# Altium project N64_Controller.PrjPcb
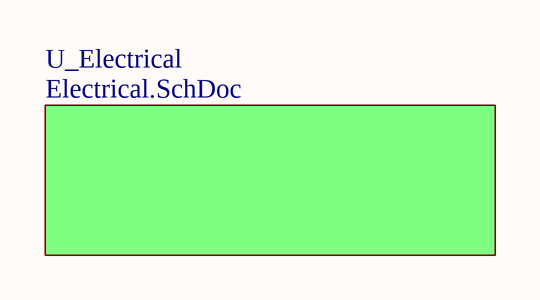
[diagram p0: TopSheet.SchDoc]
8 sheets, 143 parts. Net scope: strictly hierarchical (ports join the sheet entries above them; power ports are local).
Board file: PCB1.PcbDoc
Sheets:
  TopSheet.SchDoc
    U_Electrical = Electrical.SchDoc
      U_MCU = MCU.SchDoc
      U_LEDs = LEDs.SchDoc
      U_Rumble = Rumble.SchDoc
      U_Power = Power.SchDoc
      U_Buttons = Buttons.SchDoc
      U_USB = USB.SchDoc

## Sheet TopSheet.SchDoc
size A4

### Sub-sheets
U_Electrical = Electrical.SchDoc: no entries

### Notes on the sheet
- Title
- Size:
- Date:
- A4
- Number:
- Time:
- Revision:
- Sheet
- of
- File:

## Sheet Electrical.SchDoc
size A4
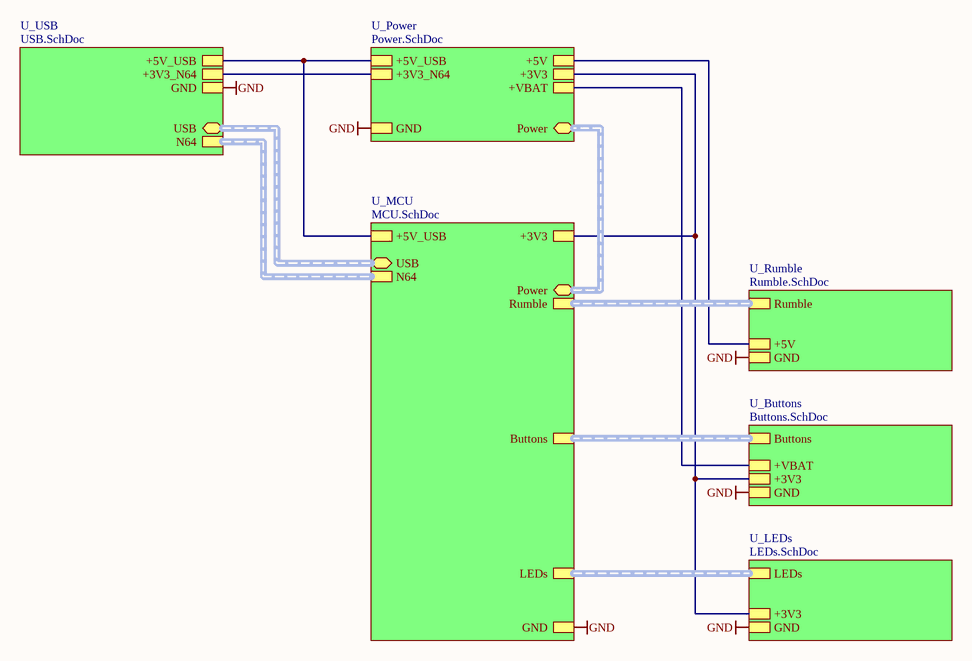
[diagram p1: Electrical.SchDoc]

### Sub-sheets
U_Buttons = Buttons.SchDoc: Buttons (harness Buttons), GND, +3V3, +VBAT
U_LEDs = LEDs.SchDoc: LEDs (harness LEDs), +3V3, GND
U_MCU = MCU.SchDoc: Buttons (harness Buttons), LEDs (harness LEDs), Rumble (harness Rumble), +3V3, +5V_USB, GND, N64 (harness N64), Power (harness Power), USB (harness USB)
U_Power = Power.SchDoc: +5V_USB, +3V3_N64, GND, +5V, +3V3, +VBAT, Power (harness Power)
U_Rumble = Rumble.SchDoc: GND, +5V, Rumble (harness Rumble)
U_USB = USB.SchDoc: +5V_USB, GND, N64 (harness N64), +3V3_N64, USB (harness USB)

### Nets
+3V3: sheet U_MCU/+3V3, sheet U_LEDs/+3V3, sheet U_Power/+3V3, sheet U_Buttons/+3V3
+3V3_N64: sheet U_Power/+3V3_N64, sheet U_USB/+3V3_N64
+5V: sheet U_Rumble/+5V, sheet U_Power/+5V
+5V_USB: sheet U_MCU/+5V_USB, sheet U_Power/+5V_USB, sheet U_USB/+5V_USB
+VBAT: sheet U_Power/+VBAT, sheet U_Buttons/+VBAT
GND: sheet U_MCU/GND, sheet U_LEDs/GND, sheet U_Rumble/GND, sheet U_Power/GND, sheet U_Buttons/GND, sheet U_USB/GND

### Buses and harness runs
harness sheet U_Buttons/Buttons = sheet U_MCU/Buttons
harness sheet U_LEDs/LEDs = sheet U_MCU/LEDs
harness sheet U_MCU/N64 = sheet U_USB/N64
harness sheet U_MCU/Power = sheet U_Power/Power
harness sheet U_MCU/Rumble = sheet U_Rumble/Rumble
harness sheet U_MCU/USB = sheet U_USB/USB

### Notes on the sheet
- Title
- Size:
- Date:
- A4
- Number:
- Time:
- Revision:
- Sheet
- of
- File:

## Sheet MCU.SchDoc: N64 Controller
size A4; Author: TheComet; Revision: 1.0.0; ProjectName: N64 Controller
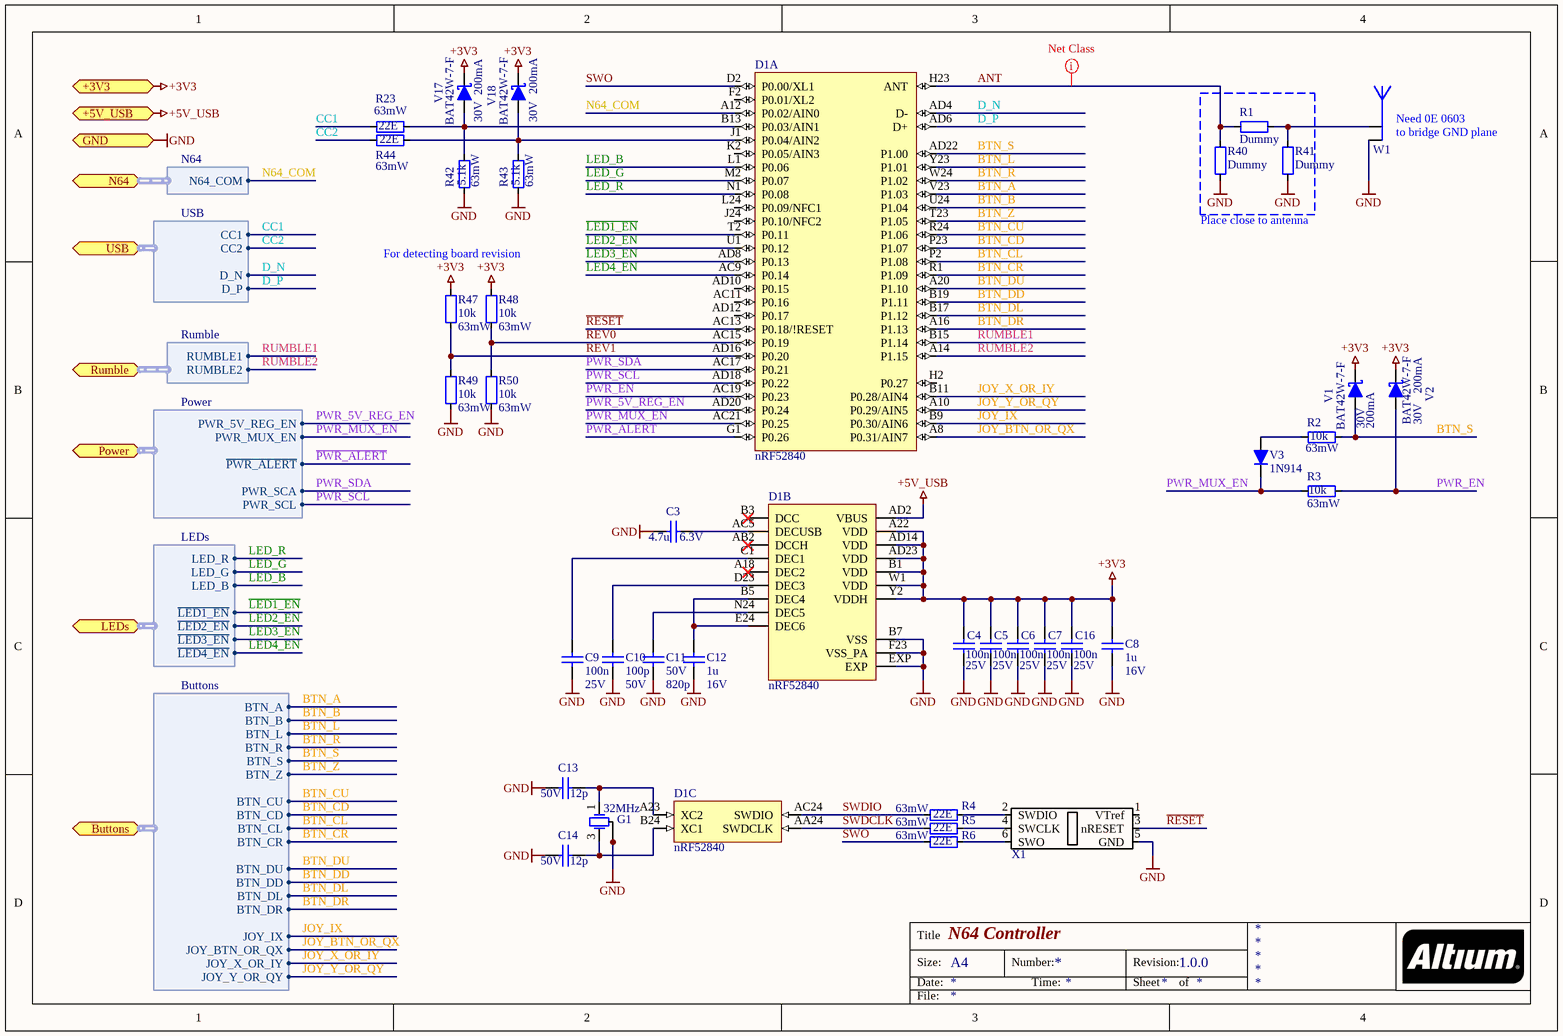
[diagram p2: MCU.SchDoc]

### Parts
C3  value 4.7u  Value2: 6.3V  [SMD_CAP_0603]  (hidden comment: C_SMD_CER_4U7_6V3_10%_X5R_0603)
C4  value 100n  Value2: 25V  [SMD_CAP_0402]  (hidden comment: C_SMD_CER_100N_25V_10%_X7R_0402)
C5  value 100n  Value2: 25V  [SMD_CAP_0402]  (hidden comment: C_SMD_CER_100N_25V_10%_X7R_0402)
C6  value 100n  Value2: 25V  [SMD_CAP_0402]  (hidden comment: C_SMD_CER_100N_25V_10%_X7R_0402)
C7  value 100n  Value2: 25V  [SMD_CAP_0402]  (hidden comment: C_SMD_CER_100N_25V_10%_X7R_0402)
C8  value 1u  Value2: 16V  [SMD_CAP_0603]  (hidden comment: C_SMD_CER_1U_16V_10%_X7R_0603)
C9  value 100n  Value2: 25V  [SMD_CAP_0402]  (hidden comment: C_SMD_CER_100N_25V_10%_X7R_0402)
C10  value 100p  Value2: 50V  [SMD_CAP_0402]  (hidden comment: C_SMD_CER_100P_50V_5%_NP0_0402)
C11  value 820p  Value2: 50V  [SMD_CAP_0402]  (hidden comment: C_SMD_CER_820P_50V_5%_NP0_0402)
C12  value 1u  Value2: 16V  [SMD_CAP_0603]  (hidden comment: C_SMD_CER_1U_16V_10%_X7R_0603)
C13  value 12p  Value2: 50V  [SMD_CAP_0402]  (hidden comment: C_SMD_CER_12P_50V_2%_NP0_0402)
C14  value 12p  Value2: 50V  [SMD_CAP_0402]  (hidden comment: C_SMD_CER_12P_50V_2%_NP0_0402)
C16  value 100n  Value2: 25V  [SMD_CAP_0402]  (hidden comment: C_SMD_CER_100N_25V_10%_X7R_0402)
D1  Type: nRF52840  [SMD_aQFN_73_nRF52840]  (hidden comment: D_NRF52840_aQFN-73)  (parts A,B,C of 3)
G1  value 32MHz  [SMD_QUARZ_3.2X2.5]  (hidden comment: G_SMD_OSC_XTAL_32MHZ_10PPM_8PF_40OHM)
R1  Dummy  [SMD_RES_0402]
R2  value 10k  Value2: 63mW  [SMD_RES_0402]  (hidden comment: R_SMD_THINFILM_10K_0W063_0%5_25PPM_0402)
R3  value 10k  Value2: 63mW  [SMD_RES_0402]  (hidden comment: R_SMD_THINFILM_10K_0W063_0%5_25PPM_0402)
R4  value 22E  Value2: 63mW  [SMD_RES_0402]  (hidden comment: R_SMD_THICKFILM_22E_0W063_1%_100PPM_0402)
R5  value 22E  Value2: 63mW  [SMD_RES_0402]  (hidden comment: R_SMD_THICKFILM_22E_0W063_1%_100PPM_0402)
R6  value 22E  Value2: 63mW  [SMD_RES_0402]  (hidden comment: R_SMD_THICKFILM_22E_0W063_1%_100PPM_0402)
R23  value 22E  Value2: 63mW  [SMD_RES_0402]  (hidden comment: R_SMD_THICKFILM_22E_0W063_1%_100PPM_0402)
R40  Dummy  [SMD_RES_0402]
R41  Dummy  [SMD_RES_0402]
R42  value 5.1k  Value2: 63mW  [SMD_CAP_0402]  (hidden comment: R_SMD_THINFILM_5K1_0W063_0%5_25PPM_0402)
R43  value 5.1k  Value2: 63mW  [SMD_CAP_0402]  (hidden comment: R_SMD_THINFILM_5K1_0W063_0%5_25PPM_0402)
R44  value 22E  Value2: 63mW  [SMD_RES_0402]  (hidden comment: R_SMD_THICKFILM_22E_0W063_1%_100PPM_0402)
R47  value 10k  Value2: 63mW  [SMD_RES_0402]  (hidden comment: R_SMD_THINFILM_10K_0W063_0%5_25PPM_0402)
R48  value 10k  Value2: 63mW  [SMD_RES_0402]  (hidden comment: R_SMD_THINFILM_10K_0W063_0%5_25PPM_0402)
R49  value 10k  Value2: 63mW  [SMD_RES_0402]  (hidden comment: R_SMD_THINFILM_10K_0W063_0%5_25PPM_0402)
R50  value 10k  Value2: 63mW  [SMD_RES_0402]  (hidden comment: R_SMD_THINFILM_10K_0W063_0%5_25PPM_0402)
V1  value 30V  Type: BAT42W-7-F  Value2: 200mA  [SMD_SOD_123]  (hidden comment: V_SMD_SCHOTTKY_BAT42W-7-F_30V_0A2_SOD-123)
V2  value 30V  Type: BAT42W-7-F  Value2: 200mA  [SMD_SOD_123]  (hidden comment: V_SMD_SCHOTTKY_BAT42W-7-F_30V_0A2_SOD-123)
V3  Type: 1N914  [SMD_SOD_323]  (hidden comment: V_SMD_DIODE_1N914_75V_0A15_SOD-323)
V17  value 30V  Type: BAT42W-7-F  Value2: 200mA  [SMD_SOD_123]  (hidden comment: V_SMD_SCHOTTKY_BAT42W-7-F_30V_0A2_SOD-123)
V18  value 30V  Type: BAT42W-7-F  Value2: 200mA  [SMD_SOD_123]  (hidden comment: V_SMD_SCHOTTKY_BAT42W-7-F_30V_0A2_SOD-123)
W1  W_BLUETOOTH_IFA_1MM  [BLUETOOTH_IFA_1MM]  (value not drawn)
X1  X_J-LINK_6-PIN_NEEDLE_HEADER  [SMD_J-LINK_6-PIN_NEEDLE]  (value not drawn)

### Ports
+3V3, +5V_USB, Buttons (harness Buttons), GND, LEDs (harness LEDs), N64 (harness N64), Power (harness Power), Rumble (harness Rumble), USB (harness USB)

### Harnesses
LEDs: LED_R, LED_G, LED_B, ~{LED1_EN}, ~{LED2_EN}, ~{LED3_EN}, ~{LED4_EN}
Rumble: RUMBLE1, RUMBLE2
N64: N64_COM
Buttons: BTN_A, BTN_B, BTN_CD, BTN_CL, BTN_CR, BTN_CU, BTN_DD, BTN_DL, BTN_DR, BTN_DU, BTN_L, BTN_R, BTN_S, BTN_Z, JOY_BTN_OR_QX, JOY_IX, JOY_X_OR_IY, JOY_Y_OR_QY
Power: ~{PWR_ALERT}, PWR_5V_REG_EN, PWR_MUX_EN, PWR_SCA, PWR_SCL
USB: CC1, CC2, D_N, D_P

### Nets
+3V3: C4.2 C5.2 C6.2 C7.2 C8.2 C16.2 D1.A22(VDD) D1.AD14(VDD) D1.AD23(VDD) D1.B1(VDD) D1.W1(VDD) D1.Y2(VDDH) R47.1 R48.1 V1.2 V2.2 V17.2 V18.2 ; port +3V3
+5V_USB: D1.AD2(VBUS) ; port +5V_USB
GND: C3.1 C4.1 C5.1 C6.1 C7.1 C8.1 C9.2 C10.1 C11.1 C12.1 C13.1 C14.1 C16.1 D1.B7(VSS) D1.EXP D1.F23(VSS_PA) G1.2 G1.4 R40.1 R41.1 R42.1 R43.1 R49.2 R50.2 W1.1(GND) X1.5(GND) ; port GND
ANT: D1.H23(ANT) R1.1 R40.2
BTN_A: D1.V23(P1.03) ; port Buttons.BTN_A
BTN_B: D1.U24(P1.04) ; port Buttons.BTN_B
BTN_CD: D1.P23(P1.07) ; port Buttons.BTN_CD
BTN_CL: D1.P2(P1.08) ; port Buttons.BTN_CL
BTN_CR: D1.R1(P1.09) ; port Buttons.BTN_CR
BTN_CU: D1.R24(P1.06) ; port Buttons.BTN_CU
BTN_DD: D1.B19(P1.11) ; port Buttons.BTN_DD
BTN_DL: D1.B17(P1.12) ; port Buttons.BTN_DL
BTN_DR: D1.A16(P1.13) ; port Buttons.BTN_DR
BTN_DU: D1.A20(P1.10) ; port Buttons.BTN_DU
BTN_L: D1.Y23(P1.01) ; port Buttons.BTN_L
BTN_R: D1.W24(P1.02) ; port Buttons.BTN_R
BTN_S: D1.AD22(P1.00) R2.2 V1.1 ; port Buttons.BTN_S
BTN_Z: D1.T23(P1.05) ; port Buttons.BTN_Z
CC1: R23.1 ; port USB.CC1
CC2: R44.1 ; port USB.CC2
D_N: D1.AD4(D-) ; port USB.D_N
D_P: D1.AD6(D+) ; port USB.D_P
JOY_BTN_OR_QX: D1.A8(P0.31/AIN7) ; port Buttons.JOY_BTN_OR_QX
JOY_IX: D1.B9(P0.30/AIN6) ; port Buttons.JOY_IX
JOY_X_OR_IY: D1.B11(P0.28/AIN4) ; port Buttons.JOY_X_OR_IY
JOY_Y_OR_QY: D1.A10(P0.29/AIN5) ; port Buttons.JOY_Y_OR_QY
~{LED1_EN}: D1.T2(P0.11) ; port LEDs.~{LED1_EN}
~{LED2_EN}: D1.U1(P0.12) ; port LEDs.~{LED2_EN}
~{LED3_EN}: D1.AD8(P0.13) ; port LEDs.~{LED3_EN}
~{LED4_EN}: D1.AC9(P0.14) ; port LEDs.~{LED4_EN}
LED_B: D1.L1(P0.06) ; port LEDs.LED_B
LED_G: D1.M2(P0.07) ; port LEDs.LED_G
LED_R: D1.N1(P0.08) ; port LEDs.LED_R
N64_COM: D1.A12(P0.02/AIN0) ; port N64.N64_COM
~{PWR_ALERT}: D1.G1(P0.26) ; port Power.~{PWR_ALERT}
PWR_5V_REG_EN: D1.AD20(P0.24) ; port Power.PWR_5V_REG_EN
PWR_EN: D1.AC19(P0.23) R3.2 V2.1
PWR_MUX_EN: D1.AC21(P0.25) R3.1 V3.2 ; port Power.PWR_MUX_EN
PWR_SCL: D1.AD18(P0.22) ; port Power.PWR_SCL
PWR_SDA: D1.AC17(P0.21) ; port Power.PWR_SCA
~{RESET}: D1.AC13(P0.18/!RESET) X1.3(nRESET)
REV0: D1.AC15(P0.19) R48.2 R50.1
REV1: D1.AD16(P0.20) R47.2 R49.1
RUMBLE1: D1.B15(P1.14) ; port Rumble.RUMBLE1
RUMBLE2: D1.A14(P1.15) ; port Rumble.RUMBLE2
SWDCLK: D1.AA24(SWDCLK) R5.1
SWDIO: D1.AC24(SWDIO) R4.1
SWO: D1.D2(P0.00/XL1) R6.1
NetC3_2: C3.2 D1.AC5(DECUSB)
NetC9_1: C9.1 D1.C1(DEC1)
NetC10_2: C10.2 D1.D23(DEC3)
NetC11_2: C11.2 D1.N24(DEC5)
NetC12_2: C12.2 D1.B5(DEC4) D1.E24(DEC6)
NetC13_2: C13.2 D1.A23(XC2) G1.1(OSC1)
NetC14_2: C14.2 D1.B24(XC1) G1.3(OSC2)
NetD1_B13: D1.B13(P0.03/AIN1) R23.2 R42.2 V17.1
NetD1_J1: D1.J1(P0.04/AIN2) R43.2 R44.2 V18.1
NetR1_2: R1.2 R41.2 W1.2(Feed)
NetR2_1: R2.1 V3.1
NetR4_2: R4.2 X1.2(SWDIO)
NetR5_2: R5.2 X1.4(SWCLK)
NetR6_2: R6.2 X1.6(SWO)

Not connected (* = marked no-connect by the designer): D1 A18(DEC2)* AB2(DCCH)* AC11(P0.16) AD10(P0.15) AD12(P0.17) B3(DCC)* F2(P0.01/XL2) H2(P0.27) J24(P0.10/NFC2) K2(P0.05/AIN3) L24(P0.09/NFC1); X1 1(VTref)

### Layout directives
net class SINGLE50: ANT

### Notes on the sheet
- (near W1) Need 0E 0603
- (near W1) to bridge GND plane
- Place close to antenna
- For detecting board revision
- Title
- Size:
- Date:
- A4
- Number:
- Time:
- Revision:
- Sheet
- of
- File:

### Library data of the parts
C4-C7 C9 C16 = C_SMD_CER_100N_25V_10%_X7R_0402: 0.1µF ±10% 25V Ceramic Capacitor X7R 0402 (1005 Metric); Supplier - Digikey: 490-14603-1-ND
C8 C12 = C_SMD_CER_1U_16V_10%_X7R_0603: 1µF ±10% 16V Ceramic Capacitor X7R 0603 (1608 Metric); Supplier - Digikey: 1276-1019-1-ND
C11 = C_SMD_CER_820P_50V_5%_NP0_0402: 820pF ±5% 50V Ceramic Capacitor C0G, NP0 0402 (1005 Metric); Supplier - Digikey: 490-11407-1-ND
C13 C14 = C_SMD_CER_12P_50V_2%_NP0_0402: 12pF ±2% 50V Ceramic Capacitor C0G, NP0 0402 (1005 Metric); Supplier - Digikey: 490-6197-1-ND
D1 = D_NRF52840_aQFN-73: IC RF TxRx + MCU 802.15.4, Bluetooth Bluetooth v5.0 2.4GHz 73-VFQFN Dual Rows, Exposed Pad; Supplier - Digikey: 1490-1071-1-ND
G1 = G_SMD_OSC_XTAL_32MHZ_10PPM_8PF_40OHM: 32MHz ±10ppm Crystal 8pF 40 Ohms 4-SMD, No Lead; Supplier - Digikey: 1908-1300-1-ND
R1 R40 R41 = R_SMD_DUMMY_0402: Dummy 0402; Value: Dummy
R2 R3 R47-R50 = R_SMD_THINFILM_10K_0W063_0%5_25PPM_0402: SMD Resistor; Supplier - Digikey: P10KDECT-ND
R4-R6 R23 R44 = R_SMD_THICKFILM_22E_0W063_1%_100PPM_0402: 22 Ohms ±1% 0.063W, 1/16W Chip Resistor 0402 (1005 Metric) Moisture Resistant Thick Film; Supplier - Digikey: 311-22.0LRCT-ND
R42 R43 = R_SMD_THINFILM_5K1_0W063_0%5_25PPM_0402: 5.1 kOhms ±0.5% 0.063W, 1/16W Chip Resistor 0402 (1005 Metric) Automotive AEC-Q200 Thin Film; Supplier - Digikey: RNCF0402DTE5K10CT-ND
V1 V2 V17 V18 = V_SMD_SCHOTTKY_BAT42W-7-F_30V_0A2_SOD-123: Diode Schottky 30V 200mA (DC) Surface Mount SOD-123; Supplier - Digikey: BAT42W-FDICT-ND
V3 = V_SMD_DIODE_1N914_75V_0A15_SOD-323: SMD Diode, 75V, 0.15A; Supplier - Digikey: 1N914BWSCT-ND
W1 = W_BLUETOOTH_IFA_1MM: Single Layer Printed IFA, 1 mm Substrate
X1 = X_J-LINK_6-PIN_NEEDLE_HEADER: J-Link 6-pin Needle Adapter (8.06.16); Supplier - Segger: 8.06.16
C3 = C_SMD_CER_4U7_6V3_10%_X5R_0603: Supplier - Digikey: 1276-1045-1-ND
C10 = C_SMD_CER_100P_50V_5%_NP0_0402: Supplier - Digikey: 311-1024-1-ND

## Sheet LEDs.SchDoc
size A4
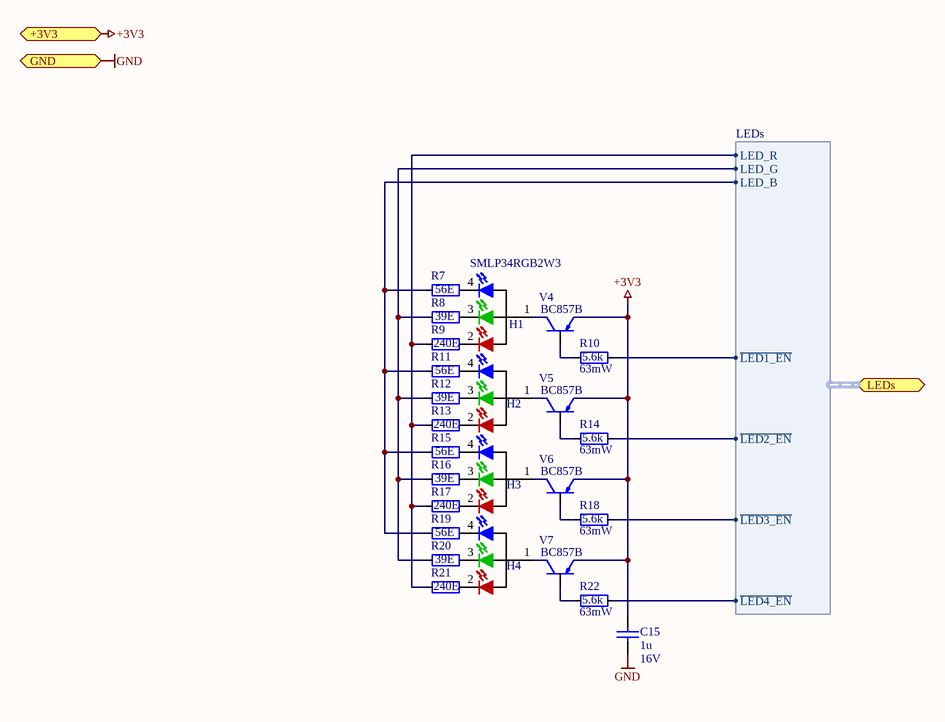
[diagram p3: LEDs.SchDoc]

### Parts
C15  value 1u  Value2: 16V  [SMD_CAP_0603]  (hidden comment: C_SMD_CER_1U_16V_10%_X7R_0603)
H1  Type: SMLP34RGB2W3  [SMD_LED_0404]  (hidden comment: H_SMD_LED_RGB_DIFFUSED_5MA_0404)
H2  H_SMD_LED_RGB_DIFFUSED_5MA_0404  [SMD_LED_0404]  (value not drawn)
H3  H_SMD_LED_RGB_DIFFUSED_5MA_0404  [SMD_LED_0404]  (value not drawn)
H4  H_SMD_LED_RGB_DIFFUSED_5MA_0404  [SMD_LED_0404]  (value not drawn)
R7  value 56E  [SMD_RES_0402]  (hidden comment: R_SMD_THINFILM_56E_0W063_0%5_50PPM_0402)
R8  value 39E  [SMD_RES_0402]  (hidden comment: R_SMD_THINFILM_39E_0W063_0%5_50PPM_0402)
R9  value 240E  [SMD_RES_0402]  (hidden comment: R_SMD_THINFILM_240E_0W063_0%5_25PPM_0402)
R10  value 5.6k  Value2: 63mW  [SMD_RES_0402]  (hidden comment: R_SMD_THINFILM_5K6_0W063_0%5_25PPM_0402)
R11  value 56E  [SMD_RES_0402]  (hidden comment: R_SMD_THINFILM_56E_0W063_0%5_50PPM_0402)
R12  value 39E  [SMD_RES_0402]  (hidden comment: R_SMD_THINFILM_39E_0W063_0%5_50PPM_0402)
R13  value 240E  [SMD_RES_0402]  (hidden comment: R_SMD_THINFILM_240E_0W063_0%5_25PPM_0402)
R14  value 5.6k  Value2: 63mW  [SMD_RES_0402]  (hidden comment: R_SMD_THINFILM_5K6_0W063_0%5_25PPM_0402)
R15  value 56E  [SMD_RES_0402]  (hidden comment: R_SMD_THINFILM_56E_0W063_0%5_50PPM_0402)
R16  value 39E  [SMD_RES_0402]  (hidden comment: R_SMD_THINFILM_39E_0W063_0%5_50PPM_0402)
R17  value 240E  [SMD_RES_0402]  (hidden comment: R_SMD_THINFILM_240E_0W063_0%5_25PPM_0402)
R18  value 5.6k  Value2: 63mW  [SMD_RES_0402]  (hidden comment: R_SMD_THINFILM_5K6_0W063_0%5_25PPM_0402)
R19  value 56E  [SMD_RES_0402]  (hidden comment: R_SMD_THINFILM_56E_0W063_0%5_50PPM_0402)
R20  value 39E  [SMD_RES_0402]  (hidden comment: R_SMD_THINFILM_39E_0W063_0%5_50PPM_0402)
R21  value 240E  [SMD_RES_0402]  (hidden comment: R_SMD_THINFILM_240E_0W063_0%5_25PPM_0402)
R22  value 5.6k  Value2: 63mW  [SMD_RES_0402]  (hidden comment: R_SMD_THINFILM_5K6_0W063_0%5_25PPM_0402)
V4  Type: BC857B  [SMD_SOT_23_3]  (hidden comment: V_SMD_TRANS_PNP_BC857B_45V_0A1_SOT-23-3)
V5  Type: BC857B  [SMD_SOT_23_3]  (hidden comment: V_SMD_TRANS_PNP_BC857B_45V_0A1_SOT-23-3)
V6  Type: BC857B  [SMD_SOT_23_3]  (hidden comment: V_SMD_TRANS_PNP_BC857B_45V_0A1_SOT-23-3)
V7  Type: BC857B  [SMD_SOT_23_3]  (hidden comment: V_SMD_TRANS_PNP_BC857B_45V_0A1_SOT-23-3)

### Ports
+3V3, GND, LEDs (harness LEDs)

### Harnesses
LEDs: ~{LED1_EN}, ~{LED2_EN}, ~{LED3_EN}, ~{LED4_EN}, LED_B, LED_G, LED_R

### Nets
+3V3: C15.2 V4.2(E) V5.2(E) V6.2(E) V7.2(E) ; port +3V3
GND: C15.1 ; port GND
~{LED1_EN}: R10.2 ; port LEDs.~{LED1_EN}
~{LED2_EN}: R14.2 ; port LEDs.~{LED2_EN}
~{LED3_EN}: R18.2 ; port LEDs.~{LED3_EN}
~{LED4_EN}: R22.2 ; port LEDs.~{LED4_EN}
LED_B: R7.1 R11.1 R15.1 R19.1 ; port LEDs.LED_B
LED_G: R8.1 R12.1 R16.1 R20.1 ; port LEDs.LED_G
LED_R: R9.1 R13.1 R17.1 R21.1 ; port LEDs.LED_R
NetH1_1: H1.1 V4.3(C)
NetH1_2: H1.2 R9.2
NetH1_3: H1.3 R8.2
NetH1_4: H1.4 R7.2
NetH2_1: H2.1 V5.3(C)
NetH2_2: H2.2 R13.2
NetH2_3: H2.3 R12.2
NetH2_4: H2.4 R11.2
NetH3_1: H3.1 V6.3(C)
NetH3_2: H3.2 R17.2
NetH3_3: H3.3 R16.2
NetH3_4: H3.4 R15.2
NetH4_1: H4.1 V7.3(C)
NetH4_2: H4.2 R21.2
NetH4_3: H4.3 R20.2
NetH4_4: H4.4 R19.2
NetR10_1: R10.1 V4.1(B)
NetR14_1: R14.1 V5.1(B)
NetR18_1: R18.1 V6.1(B)
NetR22_1: R22.1 V7.1(B)

### Notes on the sheet
- Title
- Size:
- Date:
- A4
- Number:
- Time:
- Revision:
- Sheet
- of
- File:

### Library data of the parts
C15 = C_SMD_CER_1U_16V_10%_X7R_0603: as C8 on sheet MCU; Supplier - Digikey: 1276-1019-1-ND
H1-H4 = H_SMD_LED_RGB_DIFFUSED_5MA_0404: Red, Green, Blue (RGB) 624nm Red, 527nm Green, 470nm Blue LED Indication - Discrete 2.1V Red, 3.1V Green, 3V Blue 0404 (1010 Metric); Supplier - Digikey: SMLP34RGB2W3CT-ND
R7 R11 R15 R19 = R_SMD_THINFILM_56E_0W063_0%5_50PPM_0402: 56 Ohms ±0.5% 0.063W, 1/16W Chip Resistor 0402 (1005 Metric) Thin Film; Supplier - Digikey: 311-56UCT-ND
R8 R12 R16 R20 = R_SMD_THINFILM_39E_0W063_0%5_50PPM_0402: 39 Ohms ±0.5% 0.063W, 1/16W Chip Resistor 0402 (1005 Metric) Thin Film; Supplier - Digikey: 311-39UCT-ND
R9 R13 R17 R21 = R_SMD_THINFILM_240E_0W063_0%5_25PPM_0402: 240 Ohms ±0.5% 0.063W, 1/16W Chip Resistor 0402 (1005 Metric) Automotive AEC-Q200 Thin Film; Supplier - Digikey: P240DECT-ND
R10 R14 R18 R22 = R_SMD_THINFILM_5K6_0W063_0%5_25PPM_0402: 5.6 kOhms ±0.5% 0.063W, 1/16W Chip Resistor 0402 (1005 Metric) Automotive AEC-Q200 Thin Film; Supplier - Digikey: RNCF0402DTE5K60CT-ND
V4-V7 = V_SMD_TRANS_PNP_BC857B_45V_0A1_SOT-23-3: SMD PNP Transistor BC857B 100mA 45V; Supplier - Digikey: BC857BLT3GOSCT-ND

## Sheet Rumble.SchDoc
size A4
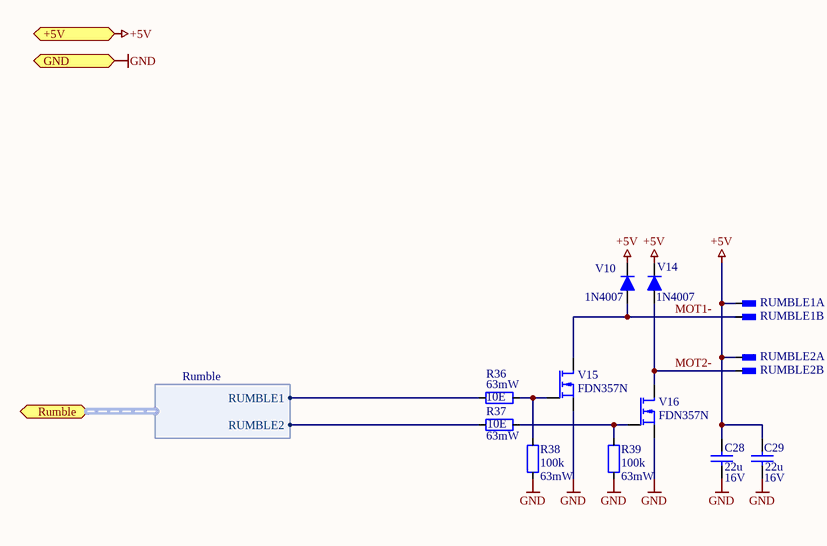
[diagram p4: Rumble.SchDoc]

### Parts
C28  value 22u  Value2: 16V  [SMD_CAP_0805]  (hidden comment: C_SMD_CER_22U_16V_10%_X5R_0805)
C29  value 22u  Value2: 16V  [SMD_CAP_0805]  (hidden comment: C_SMD_CER_22U_16V_10%_X5R_0805)
R36  value 10E  Value2: 63mW  [SMD_RES_0402]  (hidden comment: R_SMD_THINFILM_10E_0W063_0%5_50PPM_0402)
R37  value 10E  Value2: 63mW  [SMD_RES_0402]  (hidden comment: R_SMD_THINFILM_10E_0W063_0%5_50PPM_0402)
R38  value 100k  Value2: 63mW  [SMD_RES_0402]  (hidden comment: R_SMD_THINFILM_100K_0W063_1%_50PPM_0402)
R39  value 100k  Value2: 63mW  [SMD_RES_0402]  (hidden comment: R_SMD_THINFILM_100K_0W063_1%_50PPM_0402)
RUMBLE1  X_CONNECTOR_P2.54_D0.9_1X2  [THT_CON_P2.54_D0.9_1X2]  (value not drawn)  (parts A,B of 2)
RUMBLE2  X_CONNECTOR_P2.54_D0.9_1X2  [THT_CON_P2.54_D0.9_1X2]  (value not drawn)  (parts A,B of 2)
V10  Type: 1N4007  [SMD_SODFL_123]  (hidden comment: V_SMD_DIODE_1N4007_SODFL-123)
V14  Type: 1N4007  [SMD_SODFL_123]  (hidden comment: V_SMD_DIODE_1N4007_SODFL-123)
V15  Type: FDN357N  [SMD_SOT_23_3]  (hidden comment: V_SMD_FET_NMOS_FDN357N_30V_1A9_4NC2_0W5_SOT-23-3)
V16  Type: FDN357N  [SMD_SOT_23_3]  (hidden comment: V_SMD_FET_NMOS_FDN357N_30V_1A9_4NC2_0W5_SOT-23-3)

### Ports
+5V, GND, Rumble (harness Rumble)

### Harnesses
Rumble: RUMBLE1, RUMBLE2

### Nets
+5V: C28.2 C29.2 RUMBLE1.1 RUMBLE2.1 V10.2 V14.2 ; port +5V
GND: C28.1 C29.1 R38.1 R39.1 V15.2(Source) V16.2(Source) ; port GND
MOT1-: RUMBLE1.2 V10.1 V15.3(Drain)
MOT2-: RUMBLE2.2 V14.1 V16.3(Drain)
RUMBLE1: R36.1 ; port Rumble.RUMBLE1
RUMBLE2: R37.1 ; port Rumble.RUMBLE2
NetR36_2: R36.2 R38.2 V15.1(Gate)
NetR37_2: R37.2 R39.2 V16.1(Gate)

### Notes on the sheet
- Title
- Size:
- Date:
- A4
- Number:
- Time:
- Revision:
- Sheet
- of
- File:

### Library data of the parts
C28 C29 = C_SMD_CER_22U_16V_10%_X5R_0805: 22µF ±10% 16V Ceramic Capacitor X5R 0805 (2012 Metric); Supplier - Digikey: 1276-7092-1-ND
R36 R37 = R_SMD_THINFILM_10E_0W063_0%5_50PPM_0402: 10 Ohms ±0.5% 0.063W, 1/16W Chip Resistor 0402 (1005 Metric) Thin Film; Supplier - Digikey: 311-10UCT-ND
R38 R39 = R_SMD_THINFILM_100K_0W063_1%_50PPM_0402: 100 kOhms ±1% 0.063W, 1/16W Chip Resistor 0402 (1005 Metric) Thin Film; Supplier - Digikey: YAG2307CT-ND
RUMBLE1 RUMBLE2 = X_CONNECTOR_P2.54_D0.9_1X2: Pitch 2.54, Diameter 0.9mm, 1 row, 2 columns; Type: Pitch 2.54, Diameter 0.9mm, 1 row, 2 columns
V10 V14 = V_SMD_DIODE_1N4007_SODFL-123: Diode Standard 1000V 1A Surface Mount SOD-123FL; Supplier - Digikey: 1655-1N4007FLCT-ND
V15 V16 = V_SMD_FET_NMOS_FDN357N_30V_1A9_4NC2_0W5_SOT-23-3: N-Channel Logic Level Enhancement Mode Field Effect Transistor; Supplier - E+H-flowtec SAP: 50110216; Supplier - Digikey: FDN357NCT-ND

## Sheet Power.SchDoc: N64 Controller
size A4; DrawnBy: TheComet
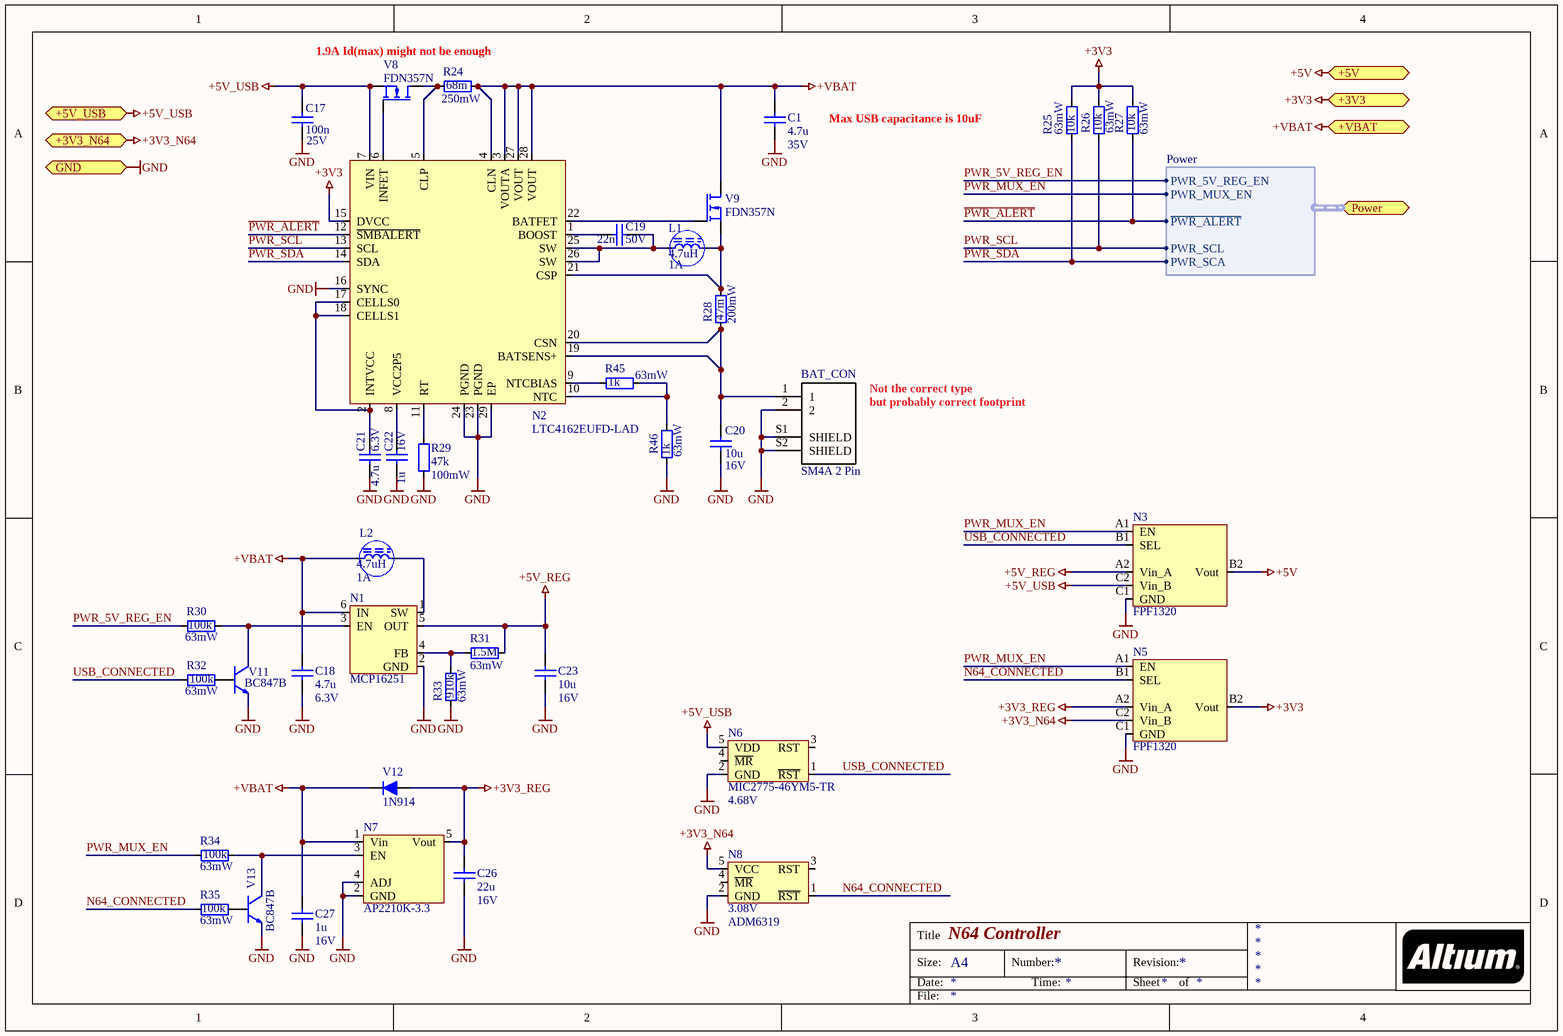
[diagram p5: Power.SchDoc]

### Parts
BAT_CON  Type: SM4A 2 Pin  [SMD_CON_SM4A_2PIN_MALE]  (hidden comment: X_SMD_SM4A_2PIN_MALE)
C1  value 4.7u  Value2: 35V  [SMD_CAP_0805]  (hidden comment: C_SMD_CER_4U7_35V_10%_X7R_0805)
C17  value 100n  Value2: 25V  [SMD_CAP_0402]  (hidden comment: C_SMD_CER_100N_25V_10%_X7R_0402)
C18  value 4.7u  Value2: 6.3V  [SMD_CAP_0603]  (hidden comment: C_SMD_CER_4U7_6V3_10%_X5R_0603)
C19  value 22n  Value2: 50V  [SMD_CAP_0402]  (hidden comment: C_SMD_CER_22N_50V_10%_X7R_0402)
C20  value 10u  Value2: 16V  [SMD_CAP_0805]  (hidden comment: C_SMD_CER_10U_16V_10%_X7R_0805)
C21  value 4.7u  Value2: 6.3V  [SMD_CAP_0603]  (hidden comment: C_SMD_CER_4U7_6V3_10%_X5R_0603)
C22  value 1u  Value2: 16V  [SMD_CAP_0603]  (hidden comment: C_SMD_CER_1U_16V_10%_X7R_0603)
C23  value 10u  Value2: 16V  [SMD_CAP_0805]  (hidden comment: C_SMD_CER_10U_16V_10%_X7R_0805)
C26  value 22u  Value2: 16V  [SMD_CAP_0805]  (hidden comment: C_SMD_CER_22U_16V_10%_X5R_0805)
C27  value 1u  Value2: 16V  [SMD_CAP_0603]  (hidden comment: C_SMD_CER_1U_16V_10%_X7R_0603)
L1  value 4.7uH  Value2: 1A  [SMD_IND_0806]  (hidden comment: L_SMD_FERRITE_SHIELD_4U7_1A_20%_0806)
L2  value 4.7uH  Value2: 1A  [SMD_IND_0806]  (hidden comment: L_SMD_FERRITE_SHIELD_4U7_1A_20%_0806)
N1  Type: MCP16251  [SMD_SOT_23_6]  (hidden comment: N_MCP16251T_SOT-23-6)
N2  Type: LTC4162EUFD-LAD  [QFN50P400X500X80_HS-29N]  (hidden comment: N_LTC4162EUFD-LAD_QFN-28)
N3  Type: FPF1320  [SMD_WLCSP_6_1.0X1.5]  (hidden comment: *)
N5  Type: FPF1320  [SMD_WLCSP_6_1.0X1.5]  (hidden comment: *)
N6  value 4.68V  Type: MIC2775-46YM5-TR  [SMD_SOT_23_5]  (hidden comment: N_MIC2775-46YM5-TR_SOT-23-5)
N7  AP2210K-3.3  [SMD_SOT_23_5]
N8  value 3.08V  Type: ADM6319  [SMD_SOT_23_5]  (hidden comment: N_ADM6319B31ARJZ-RL7_SOT-23-5)
R24  value 68m  Value2: 250mW  [SMD_RES_0603]  (hidden comment: R_SMD_THINFILM_0E068_0W25_1%_350PPM_0603)
R25  value 10k  Value2: 63mW  [SMD_RES_0402]  (hidden comment: R_SMD_THINFILM_10K_0W063_0%5_25PPM_0402)
R26  value 10k  Value2: 63mW  [SMD_RES_0402]  (hidden comment: R_SMD_THINFILM_10K_0W063_0%5_25PPM_0402)
R27  value 10k  Value2: 63mW  [SMD_RES_0402]  (hidden comment: R_SMD_THINFILM_10K_0W063_0%5_25PPM_0402)
R28  value 47m  Value2: 200mW  [SMD_RES_0603]  (hidden comment: R_SMD_THICKFILM_0E047_0W2_1%_200PPM_0603)
R29  value 47k  Value2: 100mW  [SMD_RES_0402]  (hidden comment: R_SMD_THINFILM_47K_0W1_0%5_25PPM_0402)
R30  value 100k  Value2: 63mW  [SMD_RES_0402]  (hidden comment: R_SMD_THINFILM_100K_0W063_1%_50PPM_0402)
R31  value 1.5M  Value2: 63mW  [SMD_RES_0402]  (hidden comment: R_SMD_THINFILM_1M5_0W063_1%_50PPM_0402)
R32  value 100k  Value2: 63mW  [SMD_RES_0402]  (hidden comment: R_SMD_THINFILM_100K_0W063_1%_50PPM_0402)
R33  value 910k  Value2: 63mW  [SMD_RES_0402]  (hidden comment: R_SMD_THICKFILM_910K_0W063_1%_100PPM_0402)
R34  value 100k  Value2: 63mW  [SMD_RES_0402]  (hidden comment: R_SMD_THINFILM_100K_0W063_1%_50PPM_0402)
R35  value 100k  Value2: 63mW  [SMD_RES_0402]  (hidden comment: R_SMD_THINFILM_100K_0W063_1%_50PPM_0402)
R45  value 1k  Value2: 63mW  [SMD_RES_0402]  (hidden comment: R_SMD_THINFILM_1K_0W063_0%5_25PPM_0402)
R46  value 1k  Value2: 63mW  [SMD_RES_0402]  (hidden comment: R_SMD_THINFILM_1K_0W063_0%5_25PPM_0402)
V8  Type: FDN357N  [SMD_SOT_23_3]  (hidden comment: V_SMD_FET_NMOS_FDN357N_30V_1A9_4NC2_0W5_SOT-23-3)
V9  Type: FDN357N  [SMD_SOT_23_3]  (hidden comment: V_SMD_FET_NMOS_FDN357N_30V_1A9_4NC2_0W5_SOT-23-3)
V11  Type: BC847B  [SMD_SOT_23_3]  (hidden comment: V_SMD_TRANS_NPN_BC847B_50V_0A2_SOT-23-3)
V12  Type: 1N914  [SMD_SOD_323]  (hidden comment: V_SMD_DIODE_1N914_75V_0A15_SOD-323)
V13  Type: BC847B  [SMD_SOT_23_3]  (hidden comment: V_SMD_TRANS_NPN_BC847B_50V_0A2_SOT-23-3)

### Ports
+3V3, +3V3_N64, +5V, +5V_USB, +VBAT, GND, Power (harness Power)

### Harnesses
Power: PWR_5V_REG_EN, ~{PWR_ALERT}, PWR_MUX_EN, PWR_SCL, PWR_SCA

### Nets
+3V3: N2.15(DVCC) N5.B2(Vout) R25.2 R26.2 R27.2 ; port +3V3
+3V3_N64: N5.C2(Vin_B) N8.5(VCC) ; port +3V3_N64
+3V3_REG: C26.2 N5.A2(Vin_A) N7.5(Vout) V12.1
+5V: N3.B2(Vout) ; port +5V
+5V_REG: C23.2 N1.5(OUT) N3.A2(Vin_A) R31.1
+5V_USB: C17.2 N2.7(VIN) N3.C2(Vin_B) N6.5(VDD) V8.2(Source) ; port +5V_USB
+VBAT: C1.2 C18.2 C27.2 L2.1 N1.6(IN) N2.3(VOUTA) N2.4(CLN) N2.27(VOUT) N2.28(VOUT) N7.1(Vin) R24.2 V9.3(Drain) V12.2 ; port +VBAT
GND: BAT_CON.2 BAT_CON.S1(SHIELD) BAT_CON.S2(SHIELD) C1.1 C17.1 C18.1 C20.1 C21.1 C22.1 C23.1 C26.1 C27.1 N1.2(GND) N2.16(SYNC) N2.23(PGND) N2.24(PGND) N2.29(EP) N3.C1(GND) N5.C1(GND) N6.2(GND) N7.2(GND) N7.4(ADJ) N8.2(GND) R29.1 R33.1 R46.1 V11.2(E) V13.2(E) ; port GND
N64_CONNECTED: N5.B1(SEL) N8.1(~{RST}) R35.1
~{PWR_ALERT}: N2.12(~{SMBALERT}) R27.1 ; port Power.~{PWR_ALERT}
PWR_5V_REG_EN: R30.1 ; port Power.PWR_5V_REG_EN
PWR_MUX_EN: N3.A1(EN) N5.A1(EN) R34.1 ; port Power.PWR_MUX_EN
PWR_SCL: N2.13(SCL) R26.1 ; port Power.PWR_SCL
PWR_SDA: N2.14(SDA) R25.1 ; port Power.PWR_SCA
USB_CONNECTED: N3.B1(SEL) N6.1(~{RST}) R32.1
NetBAT_CON_1: BAT_CON.1 C20.2 N2.19(BATSENS+) N2.20(CSN) R28.1
NetC19_1: C19.1 N2.1(BOOST)
NetC19_2: C19.2 L1.1 N2.25(SW) N2.26(SW)
NetC21_2: C21.2 N2.2(INTVCC) N2.17(CELLS0) N2.18(CELLS1)
NetC22_2: C22.2 N2.8(VCC2P5)
NetL1_2: L1.2 N2.21(CSP) R28.2 V9.2(Source)
NetL2_2: L2.2 N1.1(SW)
NetN1_3: N1.3(EN) R30.2 V11.3(C)
NetN1_4: N1.4(FB) R31.2 R33.2
NetN2_5: N2.5(CLP) R24.1 V8.3(Drain)
NetN2_6: N2.6(INFET) V8.1(Gate)
NetN2_9: N2.9(NTCBIAS) R45.1
NetN2_10: N2.10(NTC) R45.2 R46.2
NetN2_11: N2.11(RT) R29.2
NetN2_22: N2.22(BATFET) V9.1(Gate)
NetN7_3: N7.3(EN) R34.2 V13.3(C)
NetR32_2: R32.2 V11.1(B)
NetR35_2: R35.2 V13.1(B)

Not connected (* = marked no-connect by the designer): N6 3(RST) 4(~{MR}); N8 3(RST) 4(~{MR})

### Notes on the sheet
- 1.9A Id(max) might not be enough
- Max USB capacitance is 10uF
- Not the correct type
- but probably correct footprint
- Title
- Size:
- Date:
- A4
- Number:
- Time:
- Revision:
- Sheet
- of
- File:

### Library data of the parts
BAT_CON = X_SMD_SM4A_2PIN_MALE: Connector Header Surface Mount, Right Angle 2 position 0.059" (1.50mm); Supplier - Digikey: 455-1693-1-ND
C1 = C_SMD_CER_4U7_35V_10%_X7R_0805: SMD Capacitor, Ceramic; Supplier - Digikey: 445-172479-1-ND
C17 = C_SMD_CER_100N_25V_10%_X7R_0402: as C4 on sheet MCU; Supplier - Digikey: 490-14603-1-ND
C19 = C_SMD_CER_22N_50V_10%_X7R_0402: 0.022µF ±10% 50V Ceramic Capacitor X7R 0402 (1005 Metric); Supplier - Digikey: 490-3884-1-ND
C20 C23 = C_SMD_CER_10U_16V_10%_X7R_0805: 10µF ±10% 16V Ceramic Capacitor X7R 0805 (2012 Metric); Supplier - Digikey: 1276-6472-1-ND
C22 C27 = C_SMD_CER_1U_16V_10%_X7R_0603: as C8 on sheet MCU; Supplier - Digikey: 1276-1019-1-ND
C26 = C_SMD_CER_22U_16V_10%_X5R_0805: as C28 on sheet Rumble; Supplier - Digikey: 1276-7092-1-ND
L1 L2 = L_SMD_FERRITE_SHIELD_4U7_1A_20%_0806: SMD Inductor; Supplier - Digikey: 732-2956-1-ND
N1 = N_MCP16251T_SOT-23-6: Boost Switching Regulator IC Positive Adjustable 1.8V 1 Output 100mA (Switch) SOT-23-6; Supplier - Digikey: MCP16251T-I/CHCT-ND
N2 = N_LTC4162EUFD-LAD_QFN-28: 35V/3.2A MULTI-CELL LITHIUM-ION; Supplier - Digikey: LTC4162EUFD-LAD#PBF-ND
N3 N5 = N_FPF1320UCX_WLCSP-6: Power Switch/Driver 2:1 P-Channel 1.5A 6-WLCSP (0.96x1.66); Supplier - Digikey: FPF1320UCXCT-ND
N6 = N_MIC2775-46YM5-TR_SOT-23-5: IC SUPERVISOR MICROPOWER SOT23-5; Supplier - Digikey: 576-2684-1-ND
N7 = N_AP2210K-3.3_SOT-23-5: IC REG LINEAR 3.3V 300MA SOT23-5; Supplier - Digikey: AP2210K-3.3TRG1DICT-ND; Type: AP2210K-3.3
N8 = N_ADM6319B31ARJZ-RL7_SOT-23-5: IC SUPERVISOR MANUAL RST SOT23-5; Supplier - Digikey: ADM6319B31ARJZ-RL7DKR-ND
R24 = R_SMD_THINFILM_0E068_0W25_1%_350PPM_0603: 68 mOhms ±1% 0.25W, 1/4W Chip Resistor 0603 (1608 Metric) Current Sense Thin Film; Supplier - Digikey: 408-1445-1-ND
R25-R27 = R_SMD_THINFILM_10K_0W063_0%5_25PPM_0402: SMD Resistor; Supplier - Digikey: P10KDECT-ND
R28 = R_SMD_THICKFILM_0E047_0W2_1%_200PPM_0603: 47 mOhms ±1% 0.2W, 1/5W Chip Resistor 0603 (1608 Metric) Automotive AEC-Q200, Current Sense Thick Film; Supplier - Digikey: P47LJCT-ND
R29 = R_SMD_THINFILM_47K_0W1_0%5_25PPM_0402: 47 kOhms ±0.5% 0.063W, 1/16W Chip Resistor 0402 (1005 Metric) Automotive AEC-Q200 Thin Film; Supplier - Digikey: P47KDECT-ND
R30 R32 R34 R35 = R_SMD_THINFILM_100K_0W063_1%_50PPM_0402: as R38 on sheet Rumble; Supplier - Digikey: YAG2307CT-ND
R31 = R_SMD_THINFILM_1M5_0W063_1%_50PPM_0402: 1.5 MOhms ±1% 0.1W, 1/10W Chip Resistor 0402 (1005 Metric) Anti-Sulfur Thin Film; Supplier - Digikey: 749-1557-1-ND
R33 = R_SMD_THICKFILM_910K_0W063_1%_100PPM_0402: 910 kOhms ±1% 0.063W, 1/16W Chip Resistor 0402 (1005 Metric) Moisture Resistant Thick Film; Supplier - Digikey: YAG3257CT-ND
R45 R46 = R_SMD_THINFILM_1K_0W063_0%5_25PPM_0402: 1 kOhms ±0.5% 0.063W, 1/16W Chip Resistor 0402 (1005 Metric) Automotive AEC-Q200 Thin Film; Supplier - Digikey: P1.0KDECT-ND
V8 V9 = V_SMD_FET_NMOS_FDN357N_30V_1A9_4NC2_0W5_SOT-23-3: as V15 on sheet Rumble; Supplier - E+H-flowtec SAP: 50110216; Supplier - Digikey: FDN357NCT-ND
V11 V13 = V_SMD_TRANS_NPN_BC847B_50V_0A2_SOT-23-3: NPN Transistor; Supplier - E+H-flowtec SAP: 50019820; Supplier - Digikey: BC847BLT1GOSCT-ND
V12 = V_SMD_DIODE_1N914_75V_0A15_SOD-323: SMD Diode, 75V, 0.15A; Supplier - Digikey: 1N914BWSCT-ND
C18 C21 = C_SMD_CER_4U7_6V3_10%_X5R_0603: Supplier - Digikey: 1276-1045-1-ND

## Sheet Buttons.SchDoc
size A4
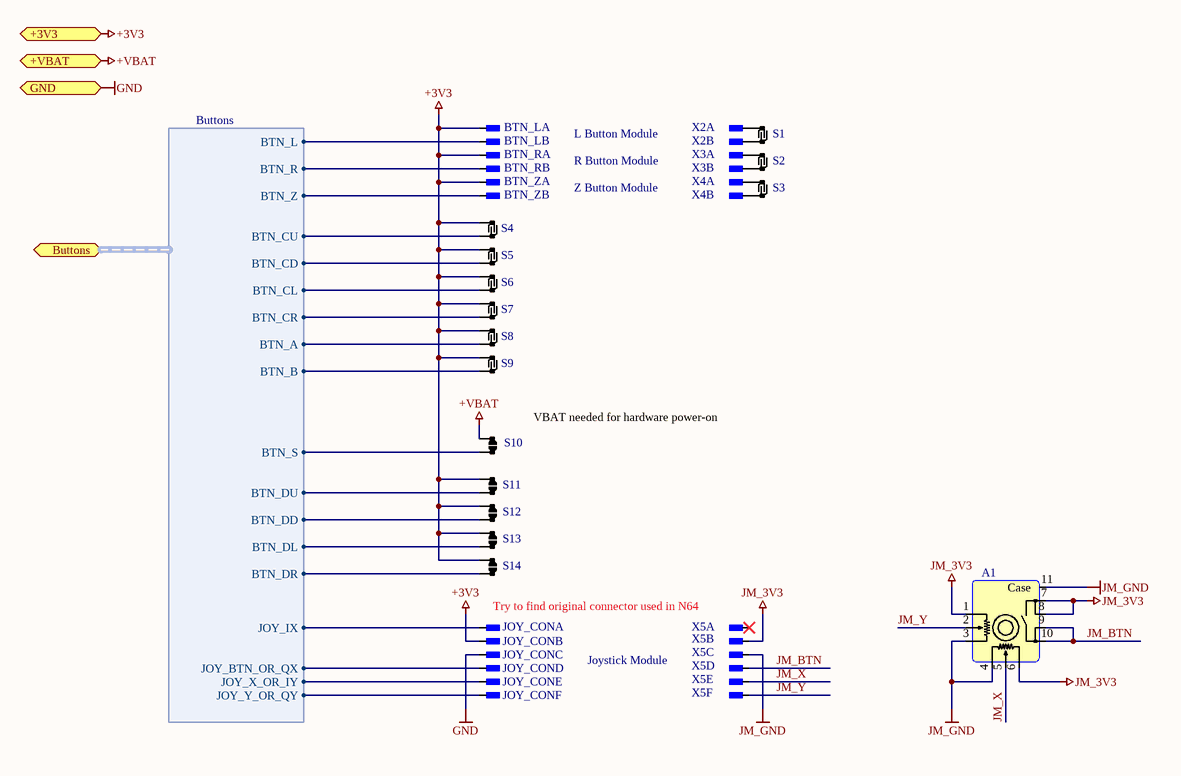
[diagram p6: Buttons.SchDoc]

### Parts
A1  A_JOYSTICK_MODULE_RKJXK122400Y  [A_JOYSTICK_MODULE_RKJXK122400Y]  (value not drawn)
BTN_L  X_CONNECTOR_P2.54_D0.9_1X2  [THT_CON_P2.54_D0.9_1X2]  (value not drawn)  (parts A,B of 2)
BTN_R  X_CONNECTOR_P2.54_D0.9_1X2  [THT_CON_P2.54_D0.9_1X2]  (value not drawn)  (parts A,B of 2)
BTN_Z  X_CONNECTOR_P2.54_D0.9_1X2  [THT_CON_P2.54_D0.9_1X2]  (value not drawn)  (parts A,B of 2)
JOY_CON  X_CONNECTOR_P2.54_D0.9_1X6  [THT_CON_P2.54_D0.9_1X6]  (value not drawn)  (parts A,B,C,D,E,F of 6)
S1  S_N64_FINGER_CARBON_CONTACT  [SMD_N64_FINGER_CARBON_CONTACT]  (value not drawn)
S2  S_N64_FINGER_CARBON_CONTACT  [SMD_N64_FINGER_CARBON_CONTACT]  (value not drawn)
S3  S_N64_FINGER_CARBON_CONTACT  [SMD_N64_FINGER_CARBON_CONTACT]  (value not drawn)
S4  S_N64_FINGER_CARBON_CONTACT  [SMD_N64_FINGER_CARBON_CONTACT]  (value not drawn)
S5  S_N64_FINGER_CARBON_CONTACT  [SMD_N64_FINGER_CARBON_CONTACT]  (value not drawn)
S6  S_N64_FINGER_CARBON_CONTACT  [SMD_N64_FINGER_CARBON_CONTACT]  (value not drawn)
S7  S_N64_FINGER_CARBON_CONTACT  [SMD_N64_FINGER_CARBON_CONTACT]  (value not drawn)
S8  S_N64_FINGER_CARBON_CONTACT  [SMD_N64_FINGER_CARBON_CONTACT]  (value not drawn)
S9  S_N64_FINGER_CARBON_CONTACT  [SMD_N64_FINGER_CARBON_CONTACT]  (value not drawn)
S10  S_N64_START_CARBON_CONTACT  [SMD_N64_START_CARBON_CONTACT]  (value not drawn)
S11  S_N64_DPAD_CARBON_CONTACT  [SMD_N64_DPAD_CARBON_CONTACT]  (value not drawn)
S12  S_N64_DPAD_CARBON_CONTACT  [SMD_N64_DPAD_CARBON_CONTACT]  (value not drawn)
S13  S_N64_DPAD_CARBON_CONTACT  [SMD_N64_DPAD_CARBON_CONTACT]  (value not drawn)
S14  S_N64_DPAD_CARBON_CONTACT  [SMD_N64_DPAD_CARBON_CONTACT]  (value not drawn)
X2  X_CONNECTOR_P2.54_D0.9_1X2  [THT_CON_P2.54_D0.9_1X2]  (value not drawn)  (parts A,B of 2)
X3  X_CONNECTOR_P2.54_D0.9_1X2  [THT_CON_P2.54_D0.9_1X2]  (value not drawn)  (parts A,B of 2)
X4  X_CONNECTOR_P2.54_D0.9_1X2  [THT_CON_P2.54_D0.9_1X2]  (value not drawn)  (parts A,B of 2)
X5  X_CONNECTOR_P2.54_D0.9_2X3  [THT_CON_P2.54_D0.9_2X3]  (value not drawn)  (parts A,B,C,D,E,F of 6)

### Ports
+3V3, +VBAT, Buttons (harness Buttons), GND

### Harnesses
Buttons: BTN_A, BTN_B, BTN_CD, BTN_CL, BTN_CR, BTN_CU, BTN_DD, BTN_DL, BTN_DR, BTN_DU, JOY_Y_OR_QY, BTN_L, BTN_R, BTN_S, BTN_Z, JOY_IX, JOY_BTN_OR_QX, JOY_X_OR_IY

### Nets
+3V3: BTN_L.1 BTN_R.1 BTN_Z.1 JOY_CON.2 S4.1 S5.1 S6.1 S7.1 S8.1 S9.1 S11.1 S12.1 S13.1 S14.1 ; port +3V3
+VBAT: S10.1 ; port +VBAT
GND: JOY_CON.3 ; port GND
JM_3V3: A1.1(XV+) A1.6(YV-) A1.7(BTN+) A1.8(BTN+) X5.2
JM_GND: A1.3(XV-) A1.4(YV+) A1.11(Case) X5.3
BTN_A: S8.2 ; port Buttons.BTN_A
BTN_B: S9.2 ; port Buttons.BTN_B
BTN_CD: S5.2 ; port Buttons.BTN_CD
BTN_CL: S6.2 ; port Buttons.BTN_CL
BTN_CR: S7.2 ; port Buttons.BTN_CR
BTN_CU: S4.2 ; port Buttons.BTN_CU
BTN_DD: S12.2 ; port Buttons.BTN_DD
BTN_DL: S13.2 ; port Buttons.BTN_DL
BTN_DR: S14.2 ; port Buttons.BTN_DR
BTN_DU: S11.2 ; port Buttons.BTN_DU
BTN_L: BTN_L.2 ; port Buttons.BTN_L
BTN_R: BTN_R.2 ; port Buttons.BTN_R
BTN_S: S10.2 ; port Buttons.BTN_S
BTN_Z: BTN_Z.2 ; port Buttons.BTN_Z
JM_BTN: A1.9(BTN-) A1.10(BTN-) X5.4
JM_X: A1.5(Y) X5.5
JM_Y: A1.2(X) X5.6
JOY_BTN_OR_QX: JOY_CON.4 ; port Buttons.JOY_BTN_OR_QX
JOY_IX: JOY_CON.1 ; port Buttons.JOY_IX
JOY_X_OR_IY: JOY_CON.5 ; port Buttons.JOY_X_OR_IY
JOY_Y_OR_QY: JOY_CON.6 ; port Buttons.JOY_Y_OR_QY
NetS1_1: S1.1 X2.1
NetS1_2: S1.2 X2.2
NetS2_1: S2.1 X3.1
NetS2_2: S2.2 X3.2
NetS3_1: S3.1 X4.1
NetS3_2: S3.2 X4.2

Not connected (* = marked no-connect by the designer): X5 1*

### Notes on the sheet
- L Button Module
- R Button Module
- Z Button Module
- VBAT needed for hardware power-on
- Try to find original connector used in N64
- Joystick Module
- Title
- Size:
- Date:
- A4
- Number:
- Time:
- Revision:
- Sheet
- of
- File:

### Library data of the parts
BTN_L BTN_R BTN_Z X2-X4 = X_CONNECTOR_P2.54_D0.9_1X2: as RUMBLE1 on sheet Rumble; Type: Pitch 2.54, Diameter 0.9mm, 1 row, 2 columns
JOY_CON = X_CONNECTOR_P2.54_D0.9_1X6: Pitch 2.54, Diameter 0.9mm, 1 row, 6 columns; Type: Pitch 2.54, Diameter 0.9mm, 1 row, 3 columns
S1-S9 = S_N64_FINGER_CARBON_CONTACT: N64 DPAD Carbon ink contact
S10 = S_N64_START_CARBON_CONTACT: N64 DPAD Carbon ink contact
S11-S14 = S_N64_DPAD_CARBON_CONTACT: N64 DPAD Carbon ink contact
X5 = X_CONNECTOR_P2.54_D0.9_2X3: Pitch 2.54, Diameter 0.9mm, 2 row, 3 columns; Type: Pitch 2.54, Diameter 0.9mm, 2 row, 3 columns
A1 = A_JOYSTICK_MODULE_RKJXK122400Y: Type: RKJXK122400Y

## Sheet USB.SchDoc
size A4
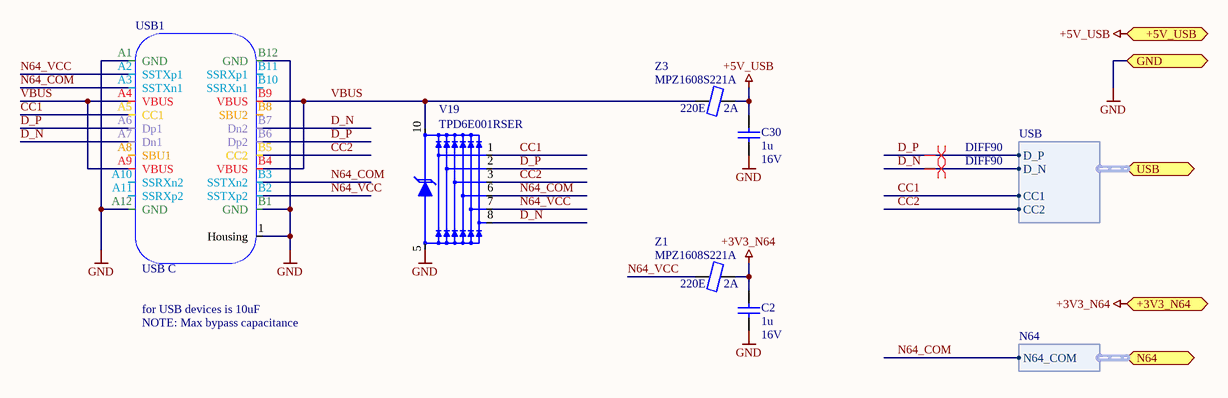
[diagram p7: USB.SchDoc]

### Parts
C2  value 1u  Value2: 16V  [SMD_CAP_0603]  (hidden comment: C_SMD_CER_1U_16V_10%_X7R_0603)
C30  value 1u  Value2: 16V  [SMD_CAP_0603]  (hidden comment: C_SMD_CER_1U_16V_10%_X7R_0603)
USB1  Type: USB C  [SMD_CON_USB_TYPEC_VERTICAL_10132328-10011LF]  (hidden comment: *)
V19  Type: TPD6E001RSER  [SMD_UQFN-10]  (hidden comment: V_SMD_TVS_TPD6E001RSER_UQFN-10)
Z1  value 220E  Type: MPZ1608S221A  Value2: 2A  [SMD_RES_0603]  (hidden comment: Z_SMD_FERRITE_2A_220E@100MHZ_0603)
Z3  value 220E  Type: MPZ1608S221A  Value2: 2A  [SMD_RES_0603]  (hidden comment: Z_SMD_FERRITE_2A_220E@100MHZ_0603)

### Ports
+3V3_N64, +5V_USB, GND, N64 (harness N64), USB (harness USB)

### Harnesses
N64: N64_COM
USB: CC1, CC2, D_N, D_P

### Nets
+3V3_N64: C2.2 Z1.2 ; port +3V3_N64
+5V_USB: C30.2 Z3.2 ; port +5V_USB
GND: C2.1 C30.1 USB1.1(Housing) USB1.A1(GND) USB1.A12(GND) USB1.B1(GND) USB1.B12(GND) V19.5 ; port GND
CC1: USB1.A5(CC1) V19.1 ; port USB.CC1
CC2: USB1.B5(CC2) V19.3 ; port USB.CC2
D_N: USB1.A7(Dn1) USB1.B7(Dn2) V19.8 ; port USB.D_N
D_P: USB1.A6(Dp1) USB1.B6(Dp2) V19.2 ; port USB.D_P
N64_COM: USB1.A3(SSTXn1) USB1.B3(SSTXn2) V19.6 ; port N64.N64_COM
N64_VCC: USB1.A2(SSTXp1) USB1.B2(SSTXp2) V19.7 Z1.1
VBUS: USB1.A4(VBUS) USB1.A9(VBUS) USB1.B4(VBUS) USB1.B9(VBUS) V19.10 Z3.1

Not connected (* = marked no-connect by the designer): USB1 A8(SBU1) A10(SSRXn2) A11(SSRXp2) B8(SBU2) B10(SSRXn1) B11(SSRXp1)

### Layout directives
differential pair; net class DIFF90: D_N, D_P

### Notes on the sheet
- for USB devices is 10uF
- NOTE: Max bypass capacitance
- Title
- Size:
- Date:
- A4
- Number:
- Time:
- Revision:
- Sheet
- of
- File:

### Library data of the parts
C2 C30 = C_SMD_CER_1U_16V_10%_X7R_0603: as C8 on sheet MCU; Supplier - Digikey: 1276-1019-1-ND
USB1 = X_CONNECTOR_USB_TYPEC_VERTICAL: USB - C (Type - C) USB 3.1 (USB 3.1 Gen 2, Superspeed+) Receptacle Connector 24 Position Surface Mount, Through Hole; Supplier - Digikey: 609-5380-1-ND
V19 = V_SMD_TVS_TPD6E001RSER_UQFN-10: Clamp Ipp Tvs Diode Surface Mount 10-UQFN (2.0x1.5); Supplier - Digikey: 296-21888-1-ND
Z1 Z3 = Z_SMD_FERRITE_2A_220E@100MHZ_0603: Ferrite Beads; Supplier - E+H Flowtec AG: 50104604; Supplier - Digikey: 445-1565-1-ND

## Nets that join several sheets
+3V3: MCU (18 pins), LEDs (5 pins), Power (5 pins), Buttons (14 pins)
+3V3_N64: Power (N5.C2 N8.5), USB (C2.2 Z1.2)
+5V: Rumble (6 pins), Power (N3.B2)
+5V_USB: MCU (D1.AD2), Power (5 pins), USB (C30.2 Z3.2)
+VBAT: Power (13 pins), Buttons (S10.1)
GND: MCU (26 pins), LEDs (C15.1), Rumble (6 pins), Power (28 pins), Buttons (JOY_CON.3), USB (8 pins)
BTN_A: MCU (D1.V23), Buttons (S8.2)
BTN_B: MCU (D1.U24), Buttons (S9.2)
BTN_CD: MCU (D1.P23), Buttons (S5.2)
BTN_CL: MCU (D1.P2), Buttons (S6.2)
BTN_CR: MCU (D1.R1), Buttons (S7.2)
BTN_CU: MCU (D1.R24), Buttons (S4.2)
BTN_DD: MCU (D1.B19), Buttons (S12.2)
BTN_DL: MCU (D1.B17), Buttons (S13.2)
BTN_DR: MCU (D1.A16), Buttons (S14.2)
BTN_DU: MCU (D1.A20), Buttons (S11.2)
BTN_L: MCU (D1.Y23), Buttons (BTN_L.2)
BTN_R: MCU (D1.W24), Buttons (BTN_R.2)
BTN_S: MCU (D1.AD22 R2.2 V1.1), Buttons (S10.2)
BTN_Z: MCU (D1.T23), Buttons (BTN_Z.2)
CC1: MCU (R23.1), USB (USB1.A5 V19.1)
CC2: MCU (R44.1), USB (USB1.B5 V19.3)
D_N: MCU (D1.AD4), USB (USB1.A7 USB1.B7 V19.8)
D_P: MCU (D1.AD6), USB (USB1.A6 USB1.B6 V19.2)
JOY_BTN_OR_QX: MCU (D1.A8), Buttons (JOY_CON.4)
JOY_IX: MCU (D1.B9), Buttons (JOY_CON.1)
JOY_X_OR_IY: MCU (D1.B11), Buttons (JOY_CON.5)
JOY_Y_OR_QY: MCU (D1.A10), Buttons (JOY_CON.6)
~{LED1_EN}: MCU (D1.T2), LEDs (R10.2)
~{LED2_EN}: MCU (D1.U1), LEDs (R14.2)
~{LED3_EN}: MCU (D1.AD8), LEDs (R18.2)
~{LED4_EN}: MCU (D1.AC9), LEDs (R22.2)
LED_B: MCU (D1.L1), LEDs (R7.1 R11.1 R15.1 R19.1)
LED_G: MCU (D1.M2), LEDs (R8.1 R12.1 R16.1 R20.1)
LED_R: MCU (D1.N1), LEDs (R9.1 R13.1 R17.1 R21.1)
N64_COM: MCU (D1.A12), USB (USB1.A3 USB1.B3 V19.6)
~{PWR_ALERT}: MCU (D1.G1), Power (N2.12 R27.1)
PWR_5V_REG_EN: MCU (D1.AD20), Power (R30.1)
PWR_MUX_EN: MCU (D1.AC21 R3.1 V3.2), Power (N3.A1 N5.A1 R34.1)
PWR_SCL: MCU (D1.AD18), Power (N2.13 R26.1)
PWR_SDA: MCU (D1.AC17), Power (N2.14 R25.1)
RUMBLE1: MCU (D1.B15), Rumble (R36.1)
RUMBLE2: MCU (D1.A14), Rumble (R37.1)